# EAGLE design esp (EAGLE 7.2.0)
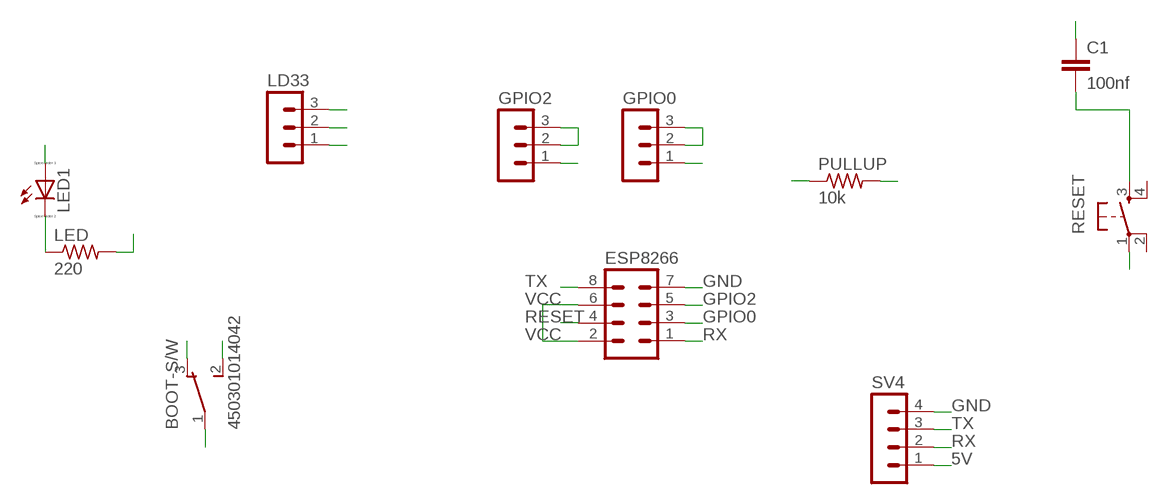
[diagram p0: schematic, sheet 1]

## Parts
BOOT-S/W  450301014042  [450301014042]
C1  100nf  C-EU025-024X044  [C025-024X044]
ESP8266  MA04-2  [MA04-2]
GPIO0  MA03-1  [MA03-1]
GPIO2  MA03-1  [MA03-1]
LD33  MA03-1  [MA03-1]
LED  220  R-US_0204/5  [0204/5]
LED1  LED_ELD260  [LED_LD260]
PULLUP  10k  R-US_0204/5  [0204/5]
RESET  DTS-6  [DTS-6]
SV4  MA04-1  [MA04-1]

## Nets
5V: LD33.1 SV4.1
GND: BOOT-S/W.3 ESP8266.7 GPIO0.1 GPIO2.1 LD33.2 LED.2 RESET.1 SV4.4
GPIO0: BOOT-S/W.1 ESP8266.3
GPIO0--: BOOT-S/W.2 GPIO0.2 GPIO0.3
GPIO2: ESP8266.5 GPIO2.2 GPIO2.3 LED1.A
N$9: LED1.K(C) LED.1
N$22: C1.2 RESET.3
RESET: C1.1 ESP8266.4 PULLUP.1
RX: ESP8266.1 SV4.2
TX: ESP8266.8 SV4.3
VCC: ESP8266.2 ESP8266.6 LD33.3 PULLUP.2
Unconnected: RESET.2 RESET.4

## Library data of the parts
BOOT-S/W = Wurth_Elektronik_Electromechanic_Switch_rev15g:450301014042: WS-SHT, 10mm*2.5mm, SPDT, ON-ON, 2.54mm, straight type, THT, Mini Slide Switch, 3 pins
C1 = resistor:C-EU: CAPACITOR, European symbol
ESP8266 = con-lstb:MA04-2: PIN HEADER; OC_FARNELL: unknown; OC_NEWARK: unknown
GPIO0 GPIO2 LD33 = con-lstb:MA03-1: PIN HEADER; OC_FARNELL: unknown; OC_NEWARK: unknown
LED PULLUP = resistor:R-US_: RESISTOR, American symbol
LED1 = eagle-ltspice:LED_E: LED Source: http://www.osram.convergy.de Source: www.luxeon.com Source: www.kingbright.com; SPICEMODEL: NONE; SPICEPREFIX: D; SPICETYPE: diode
RESET = switch-tact:DTS-6
SV4 = con-lstb:MA04-1: PIN HEADER; OC_FARNELL: unknown; OC_NEWARK: unknown

## Board
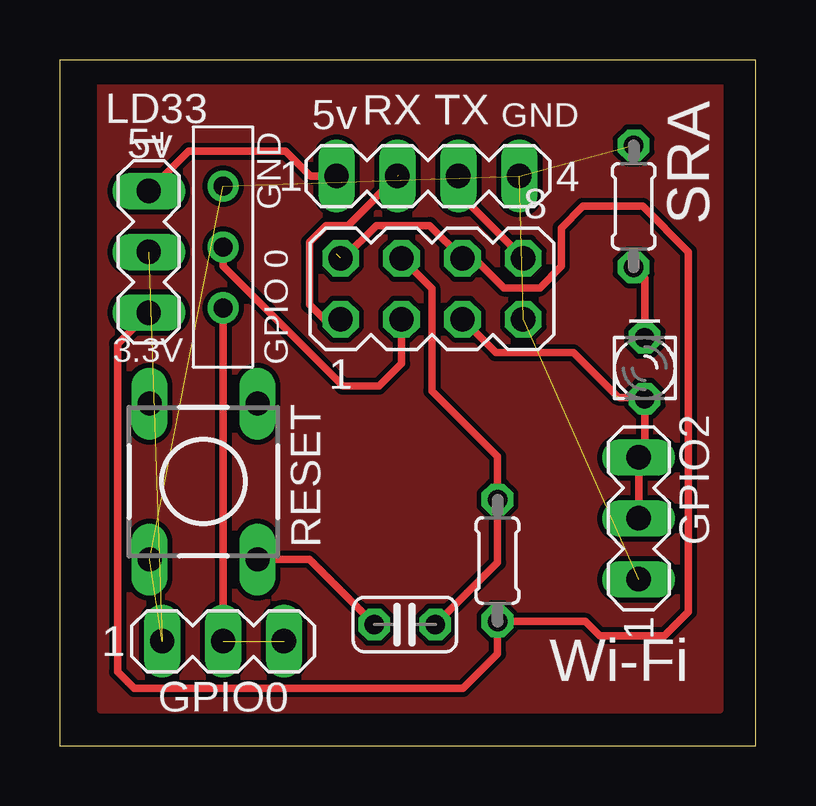
[diagram p1: board, top side]
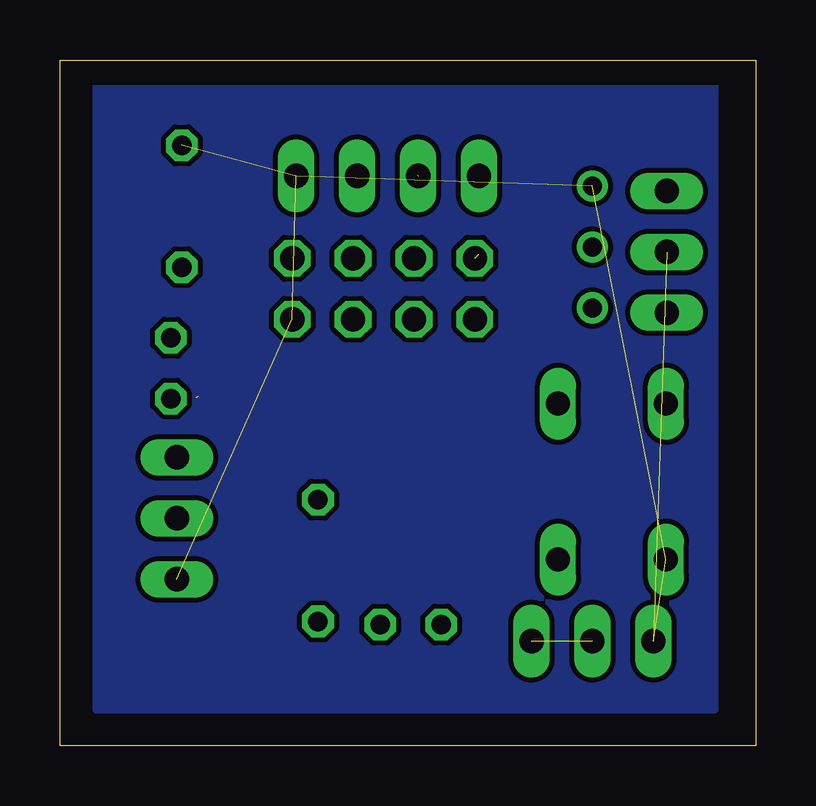
[diagram p2: board, bottom side, seen from below]

Size 29 x 28.6 mm. Coordinates in mm from the lower left corner, seen from the top.
Outline: 0,0 29,0 29,28.6 0,28.6 0,0
Copper layers (1*16): Top 0.035mm / dielectric 1.5mm / Bottom 0.035mm
Design rules "default": minimum track width 10mil, minimum drill 24mil, track to track 8mil, track to pad 8mil, pad to pad 8mil, via to via 8mil, smd to smd 8mil, copper to edge 40mil, drill to drill 8mil, minimum pad ring 10mil, minimum via ring 8mil, stop-mask expansion 4mil, vias tented up to drill 0mil, thermal gap 10mil

### Footprints (pad centres in the part's own frame; a part is rotated, then mirrored left to right if it is on the bottom)
450301014042 = drill 0.8: 1 0,0; 2 -2.54,0; 3 2.54,0
C025-024X044 = drill 0.813 octagon: 1 -1.27,0; 2 1.27,0
MA04-2 = drill 1.016 octagon: 1 -3.81,-1.27; 2 -3.81,1.27; 3 -1.27,-1.27; 4 -1.27,1.27; 5 1.27,-1.27; 6 1.27,1.27; 7 3.81,-1.27; 8 3.81,1.27
MA03-1 = drill 1.016 long: 1 -2.54,0; 2 0,0; 3 2.54,0
0204/5 = drill 0.813 octagon: 1 -2.54,0; 2 2.54,0
LED_LD260 = drill 0.813 octagon: A -1.27,0; K 1.27,0
DTS-6 = drill 1 long: 1 -3.25,2.25; 2 3.25,2.25; 3 -3.25,-2.25; 4 3.25,-2.25
MA04-1 = drill 1.016 long: 1 -3.81,0; 2 -1.27,0; 3 1.27,0; 4 3.81,0

### Placement (x,y rotation side)
BOOT-S/W  6.8,20.8 90 top
C1  14.38,5.06 180 top
ESP8266  15.51,19.06 0 top
GPIO0  6.8,4.37 0 top
GPIO2  24.13,9.49 90 top
LD33  3.7,20.6 270 top
LED  23.92,22.5 90 top
LED1  24.38,15.75 90 top
PULLUP  18.24,7.73 270 top
RESET  5.98,11.02 90 top
SV4  15.34,23.76 0 top

### Tracks (layer width: path | path; a pad name or v marks a point on that pad's centre or on a via)
5V
  Top 0.305: LD33.1 5.36,24.8 9.4,24.8 10.44,23.76 SV4.1
GND  (7 unrouted)
GPIO0
  Top 0.305: ESP8266.3 14.24,15.94 13.3,15 11.8,15 6.8,20 BOOT-S/W.1
GPIO0--  (1 unrouted)
  Top 0.305: BOOT-S/W.2 GPIO0.2
GPIO2  (1 unrouted)
  Top 0.305: ESP8266.5 18.17,16.4 21.4,16.4 23.22,14.58 | GPIO2.2 GPIO2.3 24.38,12.28 LED1.A 24.33,14.53 23.33,14.53
N$1
  pour Top: 1.7,1.5 27.5,1.5 27.5,27.8 1.7,27.8
N$2
  pour Bottom: 1.7,27.8 27.5,27.8 27.5,1.5 1.7,1.5
N$9
  Top 0.305: LED.1 24.38,19.5 LED1.K
N$22
  Top 0.305: C1.2 10.4,7.77 RESET.3
RESET
  Top 0.305: C1.1 18.24,7.65 PULLUP.1 18.24,12.06 15.5,14.8 15.5,19.07 ESP8266.4
RX  (1 unrouted)
  Top 0.305: 14.1,23.79 12.01,21.7 11.1,21.7 10.4,21 10.4,18.4 11.01,17.79 ESP8266.1
TX
  Top 0.305: SV4.3 16.61,23.04 ESP8266.8
VCC  (1 unrouted)
  Top 0.305: ESP8266.2 11.83,20.33 13.2,21.7 15.41,21.7 ESP8266.6 17.27,20.33 18.5,19.1 20,19.1 20.9,20 20.9,21.6 21.8,22.5 24.3,22.5 26.2,20.6 26.2,5.6 25.2,4.6 22.5,4.6 21.91,5.19 PULLUP.2 18.24,3.84 16.8,2.4 3.1,2.4 2.4,3.1 2.4,16.76 LD33.3

### Text on the board
tNames: SRA | GND | 5v | RX | TX | GND | 5v | GPIO 0 | 3.3V | Wi-Fi